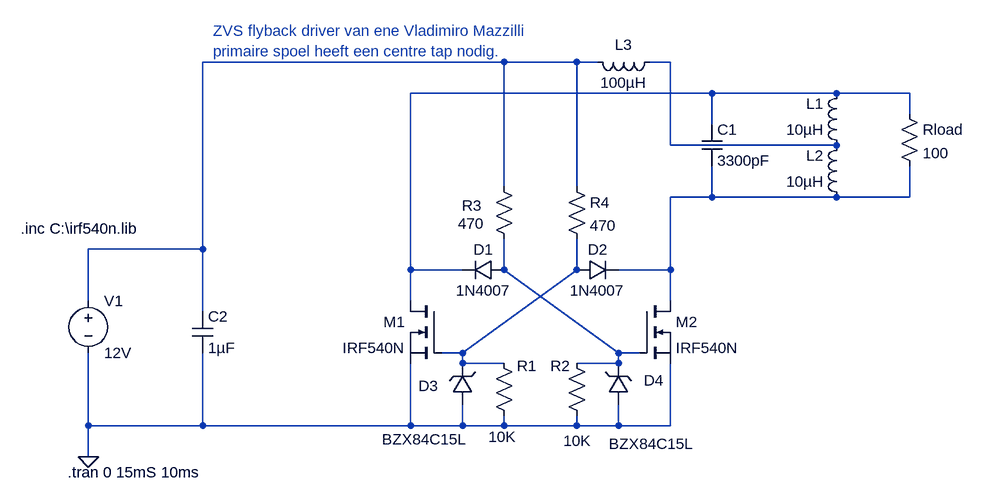
[diagram p0: schematic ZVS FBT Driver.asc]
ZVS FBT Driver.asc, the LTspice schematic file:
Version 4
SHEET 1 880 680
WIRE -192 -224 -656 -224
WIRE -80 -224 -192 -224
WIRE -48 -224 -80 -224
WIRE 64 -224 32 -224
WIRE 128 -176 -336 -176
WIRE 320 -176 128 -176
WIRE 432 -176 320 -176
WIRE 432 -144 432 -176
WIRE 128 -128 128 -176
WIRE 64 -96 64 -224
WIRE 320 -96 64 -96
WIRE -192 -32 -192 -224
WIRE -80 -32 -80 -224
WIRE 128 -16 128 -64
WIRE 128 -16 64 -16
WIRE 320 -16 128 -16
WIRE 432 -16 432 -64
WIRE 432 -16 320 -16
WIRE -656 64 -656 -224
WIRE -656 64 -832 64
WIRE -336 96 -336 -176
WIRE -256 96 -336 96
WIRE -192 96 -192 48
WIRE -80 96 -80 48
WIRE 64 96 64 -16
WIRE 64 96 -16 96
WIRE -832 144 -832 64
WIRE -336 144 -336 96
WIRE 64 144 64 96
WIRE -656 160 -656 64
WIRE -256 224 -80 96
WIRE -256 224 -288 224
WIRE -16 224 -192 96
WIRE 16 224 -16 224
WIRE -256 240 -256 224
WIRE -192 240 -256 240
WIRE -16 240 -16 224
WIRE -16 240 -80 240
WIRE -832 336 -832 224
WIRE -656 336 -656 224
WIRE -656 336 -832 336
WIRE -336 336 -336 240
WIRE -336 336 -656 336
WIRE -256 336 -256 304
WIRE -256 336 -336 336
WIRE -192 336 -192 320
WIRE -192 336 -256 336
WIRE -80 336 -80 320
WIRE -80 336 -192 336
WIRE -16 336 -16 304
WIRE -16 336 -80 336
WIRE 64 336 64 240
WIRE 64 336 -16 336
WIRE -832 384 -832 336
FLAG -832 384 0
SYMBOL voltage -832 128 R0
WINDOW 123 0 0 Left 0
WINDOW 39 0 0 Left 0
SYMATTR InstName V1
SYMATTR Value 12V
SYMBOL cap -672 160 R0
SYMATTR InstName C2
SYMATTR Value 1µF
SYMBOL nmos -288 144 M0
SYMATTR InstName M1
SYMATTR Value IRF540N
SYMATTR Prefix X
SYMBOL nmos 16 144 R0
SYMATTR InstName M2
SYMATTR Value IRF540N
SYMATTR Prefix X
SYMBOL res -208 224 R0
WINDOW 0 36 20 Left 2
WINDOW 3 -8 129 Left 2
SYMATTR InstName R1
SYMATTR Value 10K
SYMBOL res -96 224 R0
WINDOW 0 -25 20 Left 2
WINDOW 3 -5 135 Left 2
SYMATTR InstName R2
SYMATTR Value 10K
SYMBOL zener -240 304 R180
WINDOW 0 53 29 Left 2
WINDOW 3 9 -53 Left 2
SYMATTR InstName D3
SYMATTR Value BZX84C15L
SYMBOL zener -32 304 M180
WINDOW 0 55 38 Left 2
WINDOW 3 1 -60 Left 2
SYMATTR InstName D4
SYMATTR Value BZX84C15L
SYMBOL diode -192 80 R90
WINDOW 0 0 32 VBottom 2
WINDOW 3 32 32 VTop 2
SYMATTR InstName D1
SYMATTR Value 1N4007
SYMBOL diode -80 112 R270
WINDOW 0 32 32 VTop 2
WINDOW 3 0 32 VBottom 2
SYMATTR InstName D2
SYMATTR Value 1N4007
SYMBOL res -208 -48 R0
WINDOW 0 -49 45 Left 2
WINDOW 3 -55 73 Left 2
SYMATTR InstName R3
SYMATTR Value 470
SYMATTR SpiceLine pwr=2W
SYMBOL res -96 -48 R0
SYMATTR InstName R4
SYMATTR Value 470
SYMATTR SpiceLine pwr=2W
SYMBOL ind 336 -80 R180
WINDOW 0 36 80 Left 2
WINDOW 3 36 40 Left 2
SYMATTR InstName L1
SYMATTR Value 10µH
SYMBOL ind 336 0 R180
WINDOW 0 36 80 Left 2
WINDOW 3 36 40 Left 2
SYMATTR InstName L2
SYMATTR Value 10µH
SYMBOL ind 48 -240 R90
WINDOW 0 5 56 VBottom 2
WINDOW 3 32 56 VTop 2
SYMATTR InstName L3
SYMATTR Value 100µH
SYMATTR SpiceLine Rser=0.1
SYMBOL cap 112 -128 R0
SYMATTR InstName C1
SYMATTR Value 3300pF
SYMBOL res 416 -160 R0
SYMATTR InstName Rload
SYMATTR Value 100
TEXT -936 32 Left 2 !.inc C:\\irf540n.lib
TEXT -864 408 Left 2 !.tran 0 15mS 10ms
TEXT -640 -272 Left 2 ;ZVS flyback driver van ene Vladimiro Mazzilli\nprimaire spoel heeft een centre tap nodig.

The netlist it stands for:
* ZVS FBT Driver.asc
V1 N001 0 12V
C2 N001 0 1µF
XM1 N003 N006 0 IRF540N  ; pins D G S
XM2 N004 N005 0 IRF540N  ; pins D G S
R1 N006 0 10K
R2 N005 0 10K
D3 0 N006 BZX84C15L
D4 0 N005 BZX84C15L
D1 N005 N003 1N4007
D2 N006 N004 1N4007
R3 N001 N005 470 pwr=2W
R4 N001 N006 470 pwr=2W
L1 N002 N003 10µH
L2 N004 N002 10µH
L3 N002 N001 100µH Rser=0.1
C1 N003 N004 3300pF
Rload N003 N004 100
.model D D
.lib standard.dio
.inc C:\irf540n.lib
.tran 0 15mS 10ms
* ZVS flyback driver van ene Vladimiro Mazzilli
* primaire spoel heeft een centre tap nodig.
.backanno
.end